# EAGLE design pcb-main (EAGLE 7.4.0)
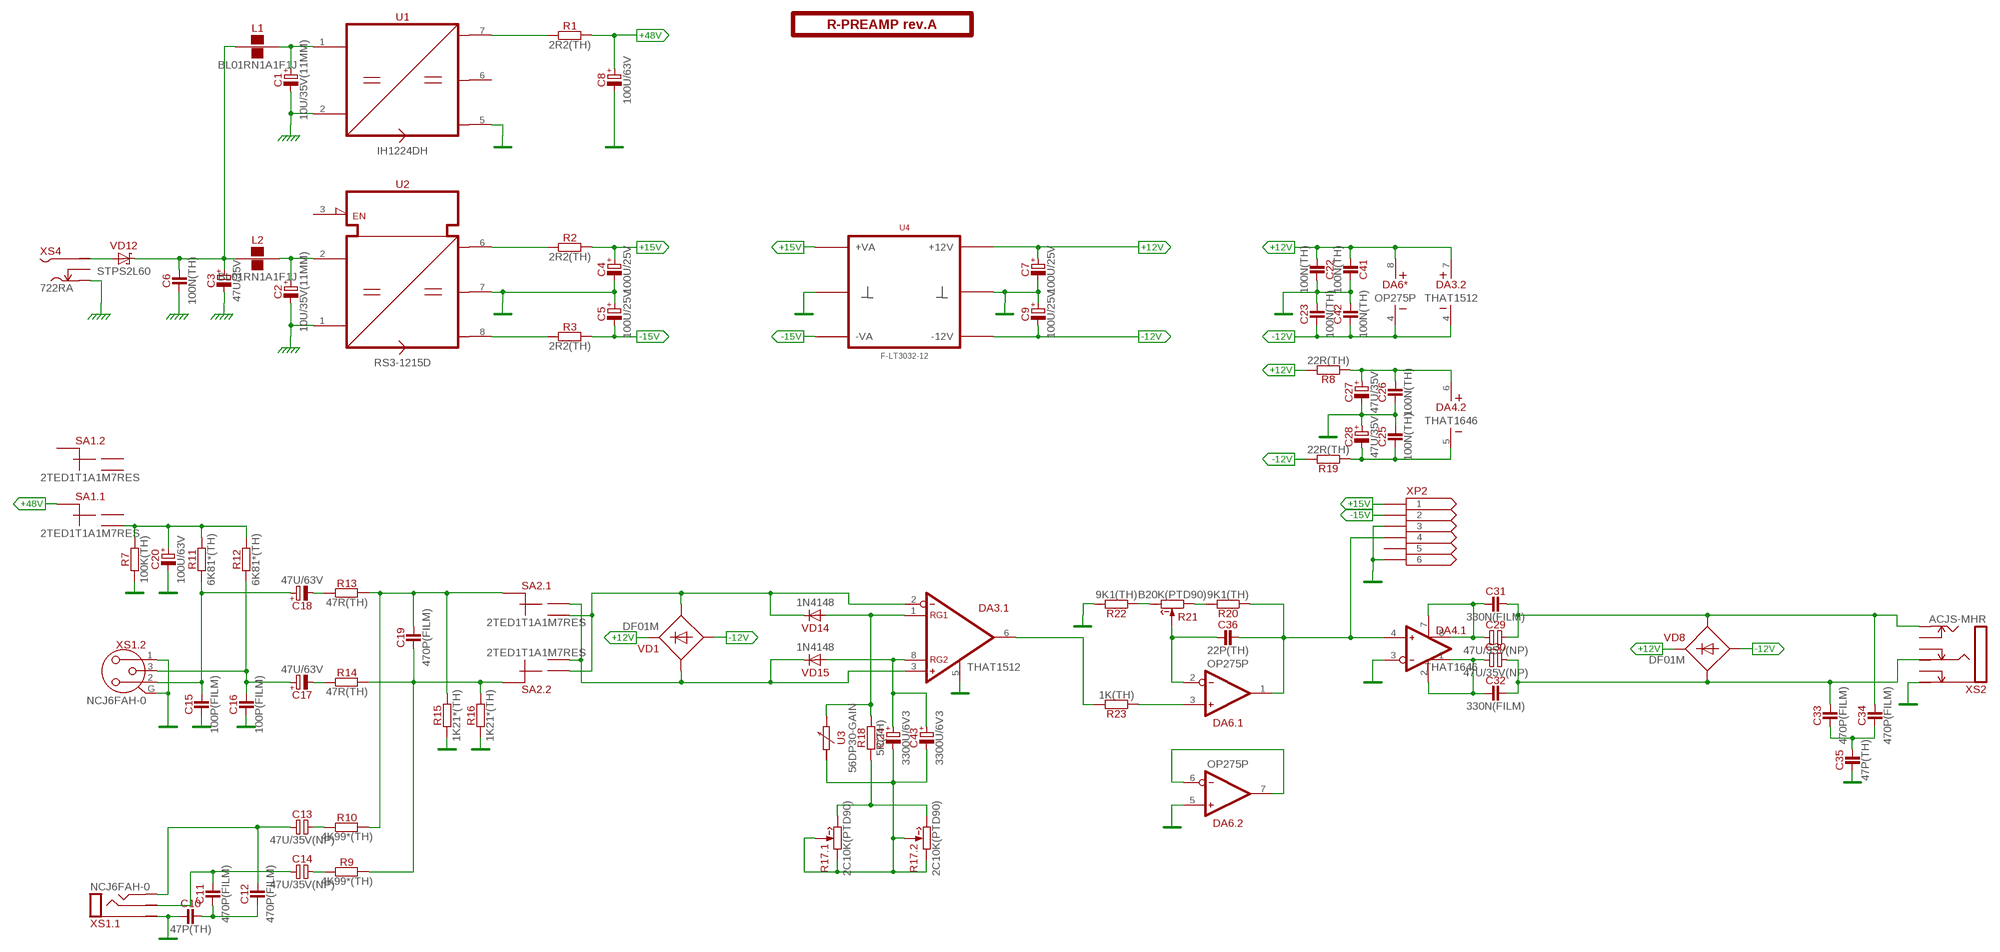
[diagram p0: schematic, sheet 1]

## Parts
C1  10U/35V(11MM)  [E2-5]
C2  10U/35V(11MM)  [E2-5]
C3  47U/35V  [E2-5]
C4  100U/25V  [E2,5-7]
C5  100U/25V  [E2,5-7]
C6  100N(TH)  [C050-024X044]
C7  100U/25V  [E2,5-7]
C8  100U/63V  [E5-10,5]
C9  100U/25V  [E2,5-7]
C10  47P(TH)  [C050-024X044]
C11  470P(FILM)  [C050-055X075]
C12  470P(FILM)  [C050-055X075]
C13  47U/35V(NP)  [E5-10,5]
C14  47U/35V(NP)  [E5-10,5]
C15  100P(FILM)  [C050-045X075]
C16  100P(FILM)  [C050-045X075]
C17  47U/63V  [E5-10,5]
C18  47U/63V  [E5-10,5]
C19  470P(FILM)  [C050-055X075]
C20  100U/63V  [E5-10,5]
C22  100N(TH)  [C050-024X044]
C23  100N(TH)  [C050-024X044]
C24  3300U/6V3  [E5-10,5]
C25  100N(TH)  [C050-024X044]
C26  100N(TH)  [C050-024X044]
C27  47U/35V  [E2-5]
C28  47U/35V  [E2-5]
C29  47U/35V(NP)  [E5-10,5]
C30  47U/35V(NP)  [E5-10,5]
C31  330N(FILM)  [C050-035X075]
C32  330N(FILM)  [C050-035X075]
C33  470P(FILM)  [C050-055X075]
C34  470P(FILM)  [C050-055X075]
C35  47P(TH)  [C050-024X044]
C36  22P(TH)  [C050-024X044]
C41  100N(TH)  [C050-024X044]
C42  100N(TH)  [C050-024X044]
C43  3300U/6V3  [E5-10,5]
DA3  THAT1512  [DIP-8]
DA4  THAT1646  [DIP-8]
DA6  OP275P  [DIP-8]
L1  BL01RN1A1F1J  [BL01RN1A]
L2  BL01RN1A1F1J  [BL01RN1A]
PCB1  R-PREAMP rev.A  GENERIC-LOGO  [F-LOGO]
R1  2R2(TH)  [R-0207/10]
R2  2R2(TH)  [R-0207/10]
R3  2R2(TH)  [R-0207/10]
R7  100K(TH)  [R-0207/10]
R8  22R(TH)  [R-0207/10]
R9  4K99*(TH)  [R-0207/10]
R10  4K99*(TH)  [R-0207/10]
R11  6K81*(TH)  [R-0207/10]
R12  6K81*(TH)  [R-0207/10]
R13  47R(TH)  [R-0207/10]
R14  47R(TH)  [R-0207/10]
R15  1K21*(TH)  [R-0207/10]
R16  1K21*(TH)  [R-0207/10]
R17  2C10K(PTD90)  [PTD902]
R18  5R(TH)  [R-0207/10]
R19  22R(TH)  [R-0207/10]
R20  9K1(TH)  [R-0207/10]
R21  B20K(PTD90)  [PTD901]
R22  9K1(TH)  [R-0207/10]
R23  1K(TH)  [R-0207/10]
SA1  2TED1T1A1M7RES  [2TED1T1A1M7RES]
SA2  2TED1T1A1M7RES  [2TED1T1A1M7RES]
U1  IH1224DH  [SIP7]
U2  RS3-1215D  [SIP8]
U3  56DP30-GAIN  F56DP  [F56DP]
U4  F-LT3032-12  F-DUAL-SUPPLY  [F-DIP8-HEATSINK]
VD1  DF01M  [MDIP-4]
VD8  DF01M  [MDIP-4]
VD12  STPS2L60  [DO41-10]
VD14  1N4148  [DO35-7]
VD15  1N4148  [DO35-7]
XP2  CONN-6-NORMAL  [MA03-2]
XS1  NCJ6FAH-0  [NCJ6FA-H-0]
XS2  ACJS-MHR  [NMJ6HC-S]
XS4  722RA  [SWITCHCRAFT-L712RA]

## Nets
+12V: C7.+ C22.2 C41.2 DA3.7(.2:V+) DA6.8(*:V+) R8.2 U4.8(P+12V) VD1.3(C) VD8.3(C)
+15V: C4.+ R2.2 U4.1(P+VA) XP2.1
+48V: C8.+ R1.2 SA1.C1(.1:CM)
-12V: C9.- C23.2 C42.2 DA3.4(.2:V-) DA6.4(*:V-) R19.2 U4.5(P-12V) VD1.4(A) VD8.4(A)
-15V: C5.- R3.2 U4.4(P-VA) XP2.2
CHASSIS: C1.- C2.- C3.- C6.1 U1.2(IN-) U2.1(IN-) XS4.S
GND: C4.- C5.+ C7.- C8.- C9.+ C10.1 C15.1 C16.1 C20.- C22.1 C23.1 C25.1 C26.2 C27.- C28.+ C35.1 C41.1 C42.1 DA3.5(.1:REF) DA4.3(.1:IN-) DA6.5(.2:IN+) R7.1 R15.1 R16.1 R22.2 U1.5(V-) U2.7(GND) U4.2(GND1) U4.3(GND1) U4.6(GND) U4.7(GND) XP2.3 XP2.6 XS1.1 XS1.G(.2:G) XS1.S(.1:S) XS2.S
N$1: C2.+ L2.2 U2.2(IN+)
N$2: VD12.A XS4.P
N$3: C1.+ L1.2 U1.1(IN+)
N$4: C13.- R10.1
N$5: C3.+ C6.2 L1.1 L2.1 VD12.C
N$6: C10.2 C11.1 C12.1
N$7: R1.1 U1.7(V+)
N$8: R2.1 U2.6(V+)
N$9: R3.1 U2.8(V-)
N$10: C11.2 C14.+ XS1.R(.1:R)
N$11: C12.2 C13.+ XS1.T1(.1:T) XS1.T2(.1:T)
N$12: C14.- R9.1
N$13: C15.2 C18.+ R11.1 XS1.2
N$14: C16.2 C17.+ R12.1 XS1.3
N$15: C26.1 C27.+ DA4.6(.2:V+) R8.1
N$16: C18.- R13.1
N$17: C17.- R14.1
N$18: DA3.2(.1:IN-) SA2.NC2 SA2.NO1 VD1.2(AC2) VD14.C
N$19: DA3.3(.1:IN+) SA2.NC1 SA2.NO2 VD1.1(AC1) VD15.C
N$21: C24.- C43.- R17.A1(CCW) R17.A2(W) R17.B1(CCW) R17.B2(W) U3.1(A) U3.2(A)
N$22: C25.2 C28.- DA4.5(.2:V-) R19.1
N$23: C20.+ R7.2 R11.2 R12.2 SA1.NO1
N$24: C29.+ C31.1 DA4.7(.1:SENS+) DA4.8(.1:OUT+)
N$25: R17.A3(CW) R17.B3(CW) R18.1
N$26: DA3.1(.1:RG1) R18.2 U3.3(E) U3.4(E) VD14.A
N$27: C24.+ C43.+ DA3.8(.1:RG2) VD15.A
N$28: C30.+ C32.1 DA4.1(.1:OUT-) DA4.2(.1:SENS-)
N$29: C29.- C31.2 C34.2 VD8.1(AC1) XS2.T
N$30: C30.- C32.2 C33.2 VD8.2(AC2) XS2.R
N$32: C33.1 C34.1 C35.2
N$33: C19.2 R10.2 R13.2 R15.2 SA2.C1(.1:CM)
N$34: C19.1 R9.2 R14.2 R16.2 SA2.C2(.2:CM)
N$35: DA6.6(.2:IN-) DA6.7(.2:OUT)
N$36: DA6.3(.1:IN+) R23.1
N$37: C36.1 DA6.2(.1:IN-) R21.2(W)
N$38: R21.3(CW) R22.1
N$39: R20.2 R21.1(CCW)
N$40: C36.2 DA4.4(.1:IN+) DA6.1(.1:OUT) R20.1 XP2.4
N$43: DA3.6(.1:OUT) R23.2
Unconnected: SA1.C2(.2:CM) SA1.NC1 SA1.NC2 SA1.NO2 U1.6(GND) U2.3(EN) XP2.5 XS2.RN XS2.SN XS2.TN XS4.SS

## Library data of the parts
C1 C2 = capacitors-electrolytic:?; MOUSER: 75-515D106M035JA6AE3
C3-C5 C7-C9 C17 C18 C20 C24 C27 C28 C43 = capacitors-electrolytic:?
C6 C22 C23 C25 C26 C41 C42 = capacitors:?; MOUSER: 81-RCER71H104K0A2H3B
C10-C12 C19 C33-C36 = capacitors:?
C13 C14 C29 C30 = capacitors-electrolytic:?(NP)
C15 C16 = capacitors:?; MOUSER: 80-PFR5101J100J11L4
C31 C32 = capacitors:?; MOUSER: 505-MKS2.33/63/10
DA3 = ic-that:THAT1512
DA4 = ic-that:THAT1646
DA6 = ic-analog-devices:OP275; MOUSER: 595-TL072IP
L1 L2 = inductors:BL01RN1A?; MOUSER: 81-BL01RN1A1F1J
PCB1 = module-footprints:GENERIC
R1-R3 R8-R16 R18-R20 R22 = resistors:?
R7 = resistors:?; MOUSER: 71-RN55D-F-100K
R17 = potentiometers:2**?(PTD90)
R21 = potentiometers:?(PTD90); MOUSER: 652-PTD901-2015KB203
R23 = resistors:?; MOUSER: 71-RN55D-F-1.0K
SA1 SA2 = switches:2TED1T1A1M7RES
U1 = regulators-switch-mode:IH1224DH
U2 = regulators-switch-mode:RS3-1215D
U3 = module-footprints:F56DP
U4 = module-footprints:F-DUAL-SUPPLY
VD1 VD8 = diodes:DF?M; MOUSER: 512-DF01M
VD12 = diodes-schottky:?; MOUSER: 511-STPS2L60RL
VD14 VD15 = diodes:?; MOUSER: 583-1N4148-T
XP2 = connectors:CONN-6-?
XS1 = connectors:NCJ6FAH-0
XS2 = connectors:ACJS-MHR; MOUSER: 523-ACJS-MHR
XS4 = connectors:722RA; MOUSER: 502-722RA

## Board
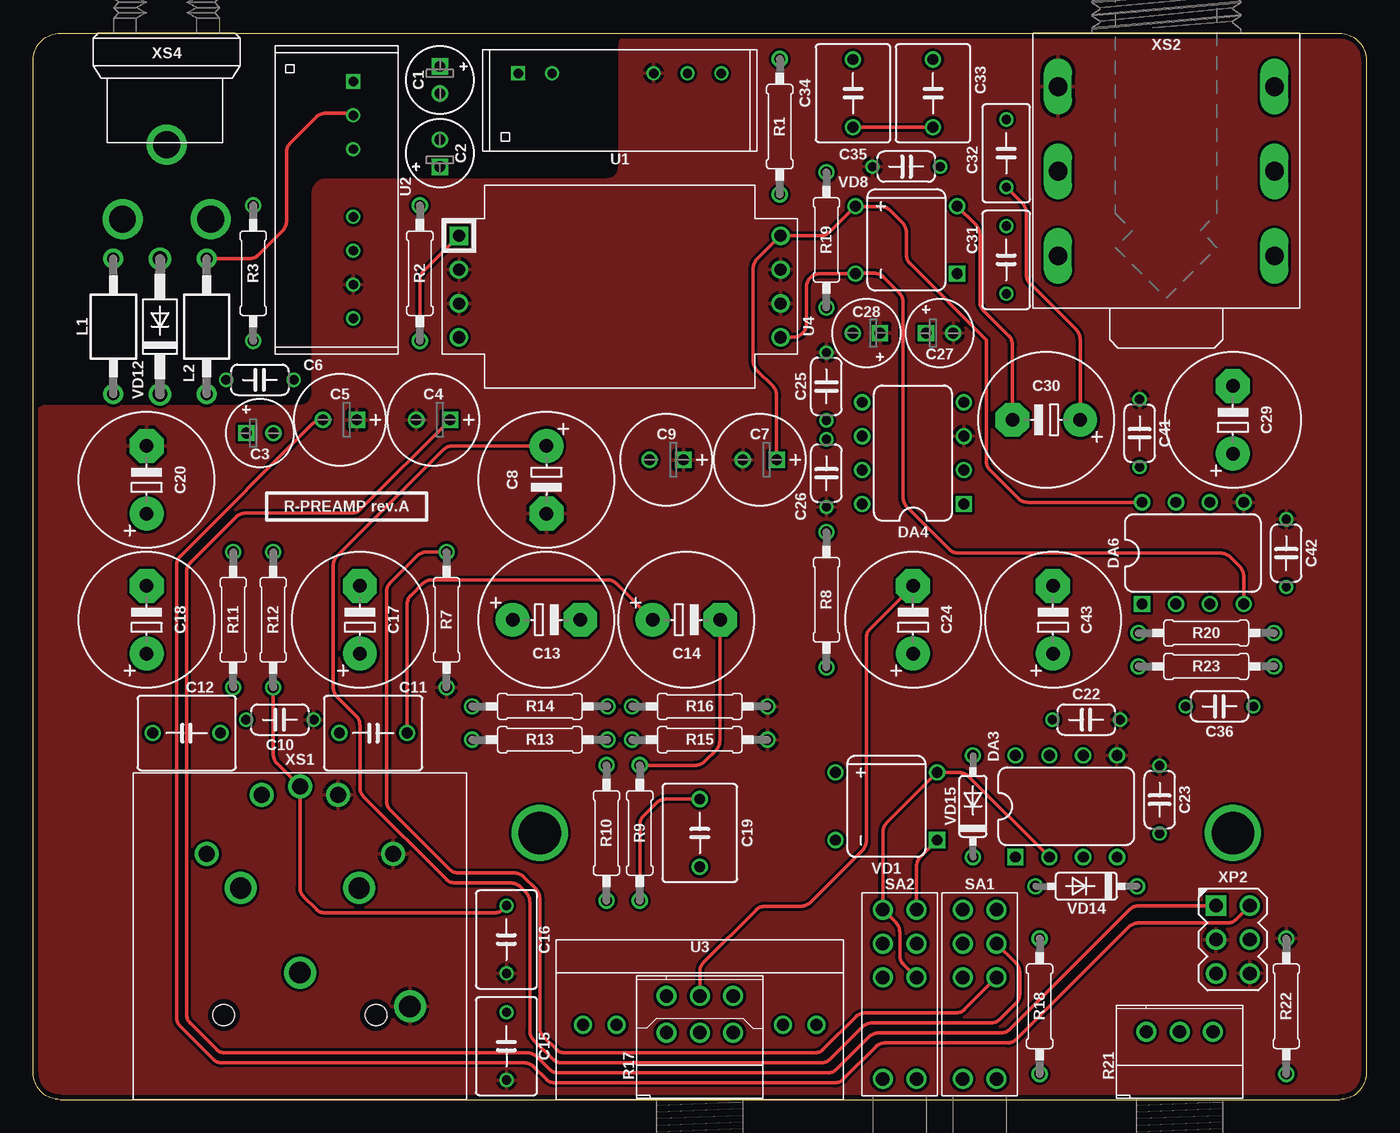
[diagram p1: board, top side]
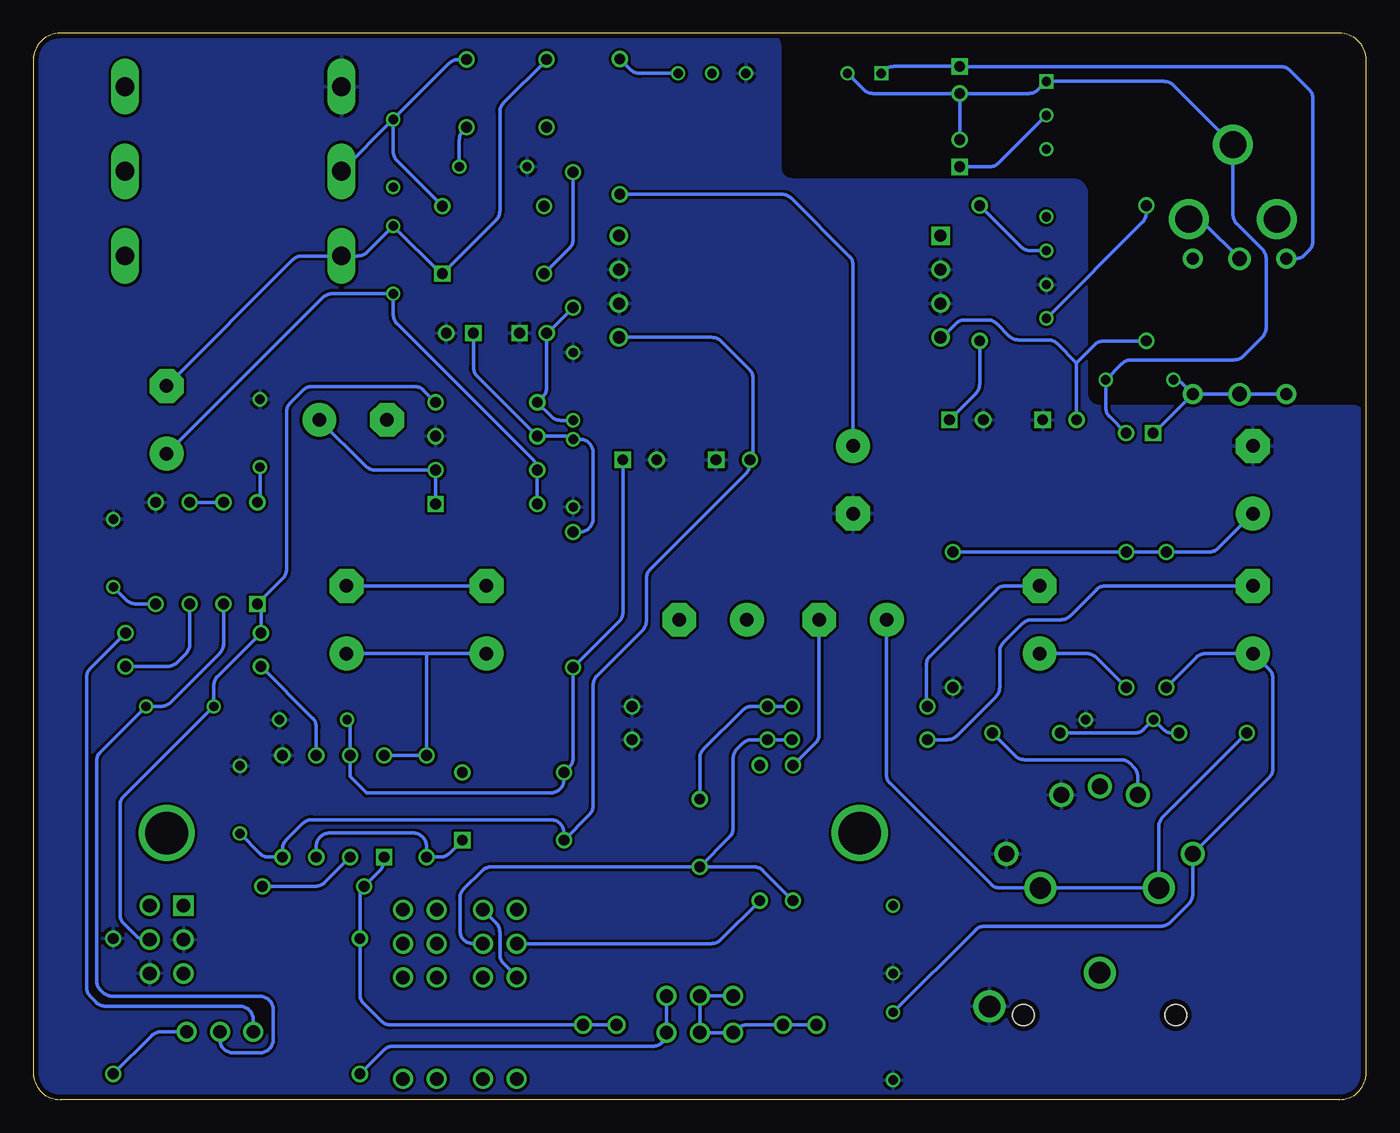
[diagram p2: board, bottom side, seen from below]

Size 100 x 80 mm. Coordinates in mm from the lower left corner, seen from the top.
Outline: 2,0 arc-90 0,2 0,78 arc-90 2,80 98,80 arc-90 100,78 100,2 arc-90 98,0 2,0
Copper layers (1*16): Top 0.0356mm / dielectric 1.5011mm / Bottom 0.0356mm
Design rules "fluorumlabs": minimum track width 6mil, minimum drill 13mil, track to track 8mil, track to pad 8mil, pad to pad 6mil, via to via 6mil, smd to smd 6mil, copper to edge 15mil, drill to drill 6mil, minimum pad ring 7mil, minimum via ring 7mil, stop-mask expansion 3mil, vias tented up to drill 25mil, thermal gap 10mil

### Footprints (pad centres in the part's own frame; a part is rotated, then mirrored left to right if it is on the bottom)
E2-5 = drill 0.813 square: + -1.016,0 | drill 0.813: - 1.016,0
E2,5-7 = drill 0.813 square: + -1.27,0 | drill 0.813: - 1.27,0
C050-024X044 = drill 0.7: 1 -2.54,0; 2 2.54,0
E5-10,5 = drill 1.016 pad 2.54: + -2.54,0 | drill 1.016 pad 2.54 octagon: - 2.54,0
C050-055X075 = drill 0.813: 1 -2.54,0; 2 2.54,0
C050-045X075 = drill 0.7: 1 -2.54,0; 2 2.54,0
C050-035X075 = drill 0.7: 1 -2.54,0; 2 2.54,0
DIP-8 = drill 0.813 square: 1 -3.81,-3.81 | drill 0.813: 2 -1.27,-3.81; 3 1.27,-3.81; 4 3.81,-3.81; 5 3.81,3.81; 6 1.27,3.81; 7 -1.27,3.81; 8 -3.81,3.81
BL01RN1A = drill 0.9 pad 1.5: 1 -5.08,0; 2 5.08,0
R-0207/10 = drill 0.813: 1 -5.08,0; 2 5.08,0
PTD902 = drill 1: A1 -2.5,5.02; A2 0,5.02; A3 2.5,5.02; B1 -2.5,7.77; B2 0,7.77; B3 2.5,7.77
PTD901 = drill 1: 1 -2.5,5.08; 2 0,5.08; 3 2.5,5.08
2TED1T1A1M7RES = drill 1: C1 1.27,11.7; C2 -1.27,11.7; NC1 1.27,14.24; NC2 -1.27,14.24; NO1 1.27,9.16; NO2 -1.27,9.16; S1 1.27,1.54; S2 -1.27,1.54
SIP7 = drill 0.7 square: 1 -7.62,0 | drill 0.7: 2 -5.08,0; 5 2.54,0; 6 5.08,0; 7 7.62,0
SIP8 = drill 0.7 square: 1 -8.89,0 | drill 0.7: 2 -6.35,0; 3 -3.81,0; 5 1.27,0; 6 3.81,0; 7 6.35,0; 8 8.89,0
F56DP = drill 0.9: 1 -8.77,5.6; 2 -6.23,5.6; 3 6.23,5.6; 4 8.77,5.6
F-DIP8-HEATSINK = drill 0.914 square: 1 -3.81,-12.065 | drill 0.914: 2 -1.27,-12.065; 3 1.27,-12.065; 4 3.81,-12.065; 5 3.81,12.065; 6 1.27,12.065; 7 -1.27,12.065; 8 -3.81,12.065
MDIP-4 = drill 0.813 square: 1 -2.54,-3.81 | drill 0.813: 2 2.54,-3.81; 3 2.54,3.81; 4 -2.54,3.81
DO41-10 = drill 1.118: A 5.08,0; C -5.08,0
DO35-7 = drill 0.813: A 3.81,0; C -3.81,0
MA03-2 = drill 1.016 square: 1 -2.54,-1.27 | drill 1.016: 2 -2.54,1.27; 3 0,-1.27; 4 0,1.27; 5 2.54,-1.27; 6 2.54,1.27
NCJ6FA-H-0 = drill 1.2: 1 -6.985,-18.415; 2 6.985,-18.415; 3 0,-23.495; R 2.857,-22.86; S -2.857,-22.86 | drill 1.6: G -8.255,-6.985; P$1 0,-9.525; T1 -4.445,-15.875; T2 4.445,-15.875 | hole 1.6: -5.715,-6.35; 5.715,-6.35
NMJ6HC-S = drill 1.4 long: R -10.35,8.115; RN -10.35,-8.115; S -4,8.115; SN -4,-8.115; T -16.7,8.115; TN -16.7,-8.115
SWITCHCRAFT-L712RA = drill 2: P 13.945,3.302; S 8.357,0; SS 13.945,-3.302

### Placement (x,y rotation side)
C1  30.5,76.5 270 top
C2  30.5,71 90 top
C3  17,50 0 top
C4  30,51 180 top
C5  23,51 180 top
C6  17,54 180 top
C7  54.5,48 180 top
C8  38.5,46.5 270 top
C9  47.5,48 180 top
C10  18.5,28.5 180 top
C11  25.5,27.5 0 top
C12  11.5,27.5 180 top
C13  38.5,36 0 top
C14  49,36 0 top
C15  35.5,4 90 top
C16  35.5,12 90 top
C17  24.5,36 90 top
C18  8.5,36 90 top
C19  50,20 270 top
C20  8.5,46.5 90 top
C22  79,28.5 180 top
C23  84.5,22.5 270 top
C24  66,36 90 top
C25  59.5,53.5 270 top
C26  59.5,47 270 top
C27  68,57.5 0 top
C28  62.5,57.5 180 top
C29  90,51 90 top
C30  76,51 180 top
C31  73,63 90 top
C32  73,71 90 top
C33  67.5,75.5 90 top
C34  61.5,75.5 90 top
C35  65.5,70 0 top
C36  89,29.5 180 top
C41  83,50 270 top
C42  94,41 270 top
C43  76.5,36 90 top
DA3  77.5,22 0 top
DA4  66,48.5 90 top
DA6  87,41 0 top
E$1  [B*-080]  0,0 0 top
L1  6,58 90 top
L2  13,58 90 top
PCB1  23.5,44.5 0 top
R1  56,73 270 top
R2  29,62 270 top
R3  16.5,62 270 top
R7  31,36 90 top
R8  59.5,37.5 270 top
R9  45.5,20 270 top
R10  43,20 270 top
R11  15,36 90 top
R12  18,36 90 top
R13  38,27 0 top
R14  38,29.5 0 top
R15  50,27 180 top
R16  50,29.5 180 top
R17  2*C10K(PTD90)  [PTD902]  50,0 0 top
R18  75.5,7 90 top
R19  59.5,64.5 90 top
R20  88,35 0 top
R21  86,0 0 top
R22  94,7 90 top
R23  88,32.5 180 top
SA1  71,0 0 top
SA2  65,0 0 top
U1  44,77 0 top
U2  24,67.5 270 top
U3  50,0 0 top
U4  44,61 270 top
VD1  64,22 90 top
VD8  65.5,64.5 90 top
VD12  9.5,58 90 top
VD14  79,16 180 top
VD15  70.5,22 90 top
XP2  90,12 270 top
XS1  20,0 180 top
XS2  85,80 90 top
XS4  10,80 270 top

### Tracks (layer width: path | path; a pad name or v marks a point on that pad's centre or on a via)
+12V
  Top 0.254: C7.+ 55.77,52.82 arc45 55.48,53.52 54.29,54.71 arc-45 54,55.41 54,62.33 arc-45 54.29,63.04 U4.8 59.05,64.81 arc45 59.75,65.1 VD8.3 61.73,67 63.59,67 arc-45 64.29,66.71 65.21,65.79 arc-45 65.5,65.09 65.5,63.41 arc45 65.79,62.71 71.5,57 71.5,47.91 arc45 71.79,47.21 73.9,45.1 arc45 74.6,44.81 DA6.8
  Bottom 0.254: C41.2 83,45 DA6.8 | C22.2 76.23,28.27 DA3.7 76.23,24.23 75,23 61.19,23 arc-90 60.19,24 VD1.3 59.79,24.94 arc-45 59.5,25.64 R8.2 56.06,35.86 arc-45 55.77,36.56 C7.+
+15V
  Top 0.254: R2.2 29,61.46 arc-45 29.29,62.17 U4.1 | XP2.1 82.95,14.54 arc45 82.25,14.25 73.29,5.29 arc-45 72.59,5 63.41,5 arc45 62.71,4.71 60.29,2.29 arc-45 59.59,2 39.41,2 arc-45 38.71,2.29 37.79,3.21 arc45 37.09,3.5 14.41,3.5 arc-45 13.71,3.79 11.79,5.71 arc-45 11.5,6.41 11.5,39.59 arc-45 11.79,40.29 15.21,43.71 arc-45 15.91,44 23.86,44 arc45 24.56,44.29 C4.+
  Bottom 0.254: R2.2 29,53.68 arc45 29.29,52.98 C4.+
+48V
  Top 0.254: C8.+ 31.45,49.04 arc45 30.75,48.75 22.79,40.79 arc45 22.5,40.09 22.5,30.91 arc45 22.79,30.21 24.21,28.79 arc-45 24.5,28.09 24.5,23.41 arc45 24.79,22.71 30.96,16.54 arc45 31.66,16.25 35.84,16.25 arc-45 36.54,15.96 36.96,15.54 arc-45 37.25,14.84 37.25,5.16 arc45 37.54,4.46 38.96,3.04 arc45 39.66,2.75 59.09,2.75 arc45 59.79,3.04 62.21,5.46 arc-45 62.91,5.75 71.84,5.75 arc45 72.54,6.04 73.71,7.21 arc45 74,7.91 74,9.56 arc45 73.71,10.26 SA1.C1
  Bottom 0.254: R1.2 43.83,67.92 arc45 43.13,67.63 38.79,63.29 arc45 38.5,62.59 C8.+
-12V
  Top 0.254: U4.5 57,57.19 arc90 58,58.19 58,60.96 arc-90 59,61.96 VD8.4 61.73,62 63.09,62 arc-45 63.79,61.71 64.96,60.54 arc-45 65.25,59.84 65.25,45.16 arc45 65.54,44.46 68.71,41.29 arc45 69.41,41 89.09,41 arc-45 89.79,40.71 90.52,39.98 arc-45 90.81,39.28 DA6.4
  Bottom 0.254: C23.2 83.02,18.48 arc-45 82.32,18.19 DA3.4 81.31,18.78 arc45 81.02,19.48 79.79,20.71 arc45 79.09,21 61.19,21 arc90 60.19,20 VD1.4 58.29,21.36 arc-45 58,22.06 58,31.09 arc45 57.71,31.79 54.29,35.21 arc-45 54,35.91 54,39.09 arc45 53.71,39.79 46.52,46.98 arc-45 46.23,47.68 C9.- 46,48.23 46,54.09 arc-45 46.29,54.79 48.4,56.9 arc-45 49.1,57.19 U4.5 | DA6.4 92.32,37.19 arc45 93.02,37.48 C42.2 | R19.2 59.5,64.56 arc45 59.79,63.86 VD8.4
-15V
  Top 0.254: XP2.2 91.27,14.52 90.29,13.54 arc-45 89.59,13.25 82.91,13.25 arc45 82.21,12.96 73.79,4.54 arc-45 73.09,4.25 63.91,4.25 arc45 63.21,3.96 60.79,1.54 arc-45 60.09,1.25 39.16,1.25 arc-45 38.46,1.54 37.54,2.46 arc45 36.84,2.75 14.16,2.75 arc-45 13.46,3.04 11.04,5.46 arc-45 10.75,6.16 10.75,40.09 arc-45 11.04,40.79 20.96,50.71 arc-45 21.66,51 C5.-
  Bottom 0.254: R3.2 19.67,56.92 arc-45 20.37,56.63 21.73,55.27 | C5.- 21.73,55.27 | U4.4 31.81,57.19 30.79,58.21 arc45 30.09,58.5 28.41,58.5 arc45 27.71,58.21 26.79,57.29 arc-45 26.09,57 23.87,57 arc45 23.17,56.71 21.73,55.27
CHASSIS
  Bottom 0.254: C3.- 19.25,51.23 arc45 19.54,51.94 C6.1 18.33,55.21 arc45 17.63,55.5 9.91,55.5 arc-45 9.21,55.79 7.79,57.21 arc-45 7.5,57.91 7.5,63.09 arc-45 7.79,63.79 9.71,65.71 arc45 10,66.41 XS4.S 14.45,76.1 arc-45 15.16,76.39 U2.1 24.61,75.78 arc45 25.32,75.48 C1.- | C1.- 36.99,75.48 arc45 37.7,75.78 U1.2 | C2.- C1.-
GND
  pour Bottom: 100,80 100,0 0,0 0,51 arc-90 1,52 20,52 arc90 21,53 21,68 arc-90 22,69 43,69 arc90 44,70 44,79 arc-90 45,80
  pour Top: 44,70 44,79 arc-90 45,80 100,80 100,0 0,0 0,51 arc-90 1,52 20,52 arc90 21,53 21,68 arc-90 22,69 43,69 arc90
N$1
  Top 0.254: L2.2 16.17,63.08 arc45 16.87,63.37 18.71,65.21 arc45 19,65.91 19,71.09 arc-45 19.29,71.79 21.21,73.71 arc-45 21.91,74 23.85,74 U2.2
  Bottom 0.254: C2.+ 28.28,69.98 arc-45 27.57,70.28 U2.2
N$2
  Bottom 0.254: XS4.P 12.89,66.06 arc45 12.18,65.76 VD12.A
N$3
  Bottom 0.254: U1.1 36.16,77.22 arc45 35.45,77.52 C1.+ 30.48,77.5 6.41,77.5 arc45 5.71,77.21 4.29,75.79 arc45 4,75.09 4,64.41 arc45 4.29,63.71 4.63,63.37 arc45 5.33,63.08 L1.2
N$4
  Bottom 0.254: C13.- 41.04,27.45 arc45 41.33,26.75 R10.1
N$5
  Bottom 0.254: L1.1 VD12.C L2.1 | C6.2 arc45 13.81,53.73 L2.1 | C3.+ 15.92,50 L2.1
N$6
  Bottom 0.254: C12.1 14.55,27.5 arc45 15.25,27.79 C10.2 16.67,27.79 arc45 17.37,27.5 C11.1
N$7
  Bottom 0.254: U1.7 54.51,77 arc45 55.21,77.29 R1.1
N$8
  Bottom 0.254: U2.6 25.2,63.69 arc45 25.9,63.98 R2.1
N$9
  Bottom 0.254: R3.1 16.5,66.52 arc45 16.79,65.82 U2.8
N$10
  Top 0.254: C11.2 28.04,37.13 arc-45 28.33,37.83 29.21,38.71 arc-45 29.91,39 43.05,39 arc-45 43.75,38.71 C14.+
  Bottom 0.254: XS1.R 17.14,24.23 arc-45 17.43,24.93 17.71,25.21 arc-45 18.41,25.5 25.63,25.5 arc45 26.33,25.79 C11.2
N$11
  Bottom 0.254: C12.2 15.26,21.2 arc-45 15.55,20.49 XS1.T2 XS1.T1 27.46,15.88 arc45 28.17,16.17 35.71,23.71 arc45 36,24.41 36,35.96 C13.+
N$12
  Top 0.254: R9.1 49.67,25.08 arc45 50.37,25.37 51.21,26.21 arc45 51.5,26.91 51.5,35.96 C14.-
N$13
  Bottom 0.254: C15.2 29.33,12.71 arc45 28.63,13 15.41,13 arc-45 14.71,13.29 13.31,14.69 arc-45 13.02,15.4 XS1.2 7.29,24.14 arc-45 7,24.84 7,31.59 arc-45 7.29,32.29 8.46,33.46 C18.+ 12.05,33.46 arc-45 12.75,33.17 R11.1
N$14
  Top 0.254: R12.1 18,25.91 arc45 18.29,25.2 XS1.3 20,15.91 arc45 20.29,15.21 21.21,14.29 arc45 21.91,14 34.55,14 arc45 35.25,14.29 C16.2
  Bottom 0.254: C17.+ 20.95,33.46 arc45 20.25,33.17 R12.1
N$15
  Bottom 0.254: C27.+ 66.98,54.98 arc-45 66.69,54.27 DA4.6 59.73,49.77 C26.1 59,49.54 arc90 58,48.54 58,43.58 arc90 59,42.58 R8.1
N$16
  Bottom 0.254: C18.- 19.55,38.54 arc-45 20.25,38.25 22.21,36.29 arc45 22.91,36 25.09,36 arc-45 25.79,35.71 27.21,34.29 arc-45 27.5,33.59 27.5,30.91 arc45 27.79,30.21 30.71,27.29 arc45 31.41,27 R13.1
N$17
  Bottom 0.254: C17.- 27.05,38.54 arc-45 27.75,38.25 32.71,33.29 arc-45 33,32.59 33,29.58 R14.1
N$18
  Top 0.254: SA2.NO1 65.29,10.14 arc-45 65,10.84 65,12.59 arc45 64.71,13.29 63.76,14.24 SA2.NC2 63.73,20.05 arc-45 64.02,20.75 VD1.2 69.47,24.54 arc-45 70.17,24.25 DA3.2
  Bottom 0.254: VD14.C 78.83,16 arc-45 78.13,16.29 DA3.2
N$19
  Top 0.254: SA2.NC1 66.27,17.51 arc-45 66.56,18.21 VD1.1
  Bottom 0.254: DA3.3 78.77,19 arc90 77.77,20 71.5,20 arc90 70.5,19 VD15.C 69.49,18.19 arc-45 68.79,18.48 VD1.1 | SA2.NO2 63.73,9.23 64.71,10.21 arc45 65,10.91 65,12.56 arc-45 65.29,13.26 SA2.NC1
N$21
  Top 0.254: R17.B2 50,9.59 arc-45 50.29,10.29 54.21,14.21 arc-45 54.91,14.5 57.59,14.5 arc45 58.29,14.79 62.21,18.71 arc45 62.5,19.41 62.5,34.63 arc-45 62.79,35.33 C24.-
  Bottom 0.254: R17.B1 R17.B2 R17.A2 R17.A1 47.21,5.31 arc45 46.51,5.6 U3.2 U3.1 | C43.- C24.-
N$22
  Bottom 0.254: C25.2 60.43,50.96 arc45 61.13,51.25 DA4.5 61.78,52.72 arc-45 61.48,53.43 C28.- 61.42,57.5 R19.1
N$23
  Top 0.254: R7.2 29.49,41.08 arc45 28.79,40.79 26.79,38.79 arc45 26.5,38.09 26.5,22.41 arc45 26.79,21.71 31.21,17.29 arc45 31.91,17 36.09,17 arc-45 36.79,16.71 37.71,15.79 arc-45 38,15.09 38,5.41 arc45 38.29,4.71 39.21,3.79 arc45 39.91,3.5 58.59,3.5 arc45 59.29,3.79 61.71,6.21 arc-45 62.41,6.5 69.2,6.5 arc45 69.9,6.79 SA1.NO1
  Bottom 0.254: C20.+ 11.09,41.37 arc45 11.79,41.08 R11.2 R12.2 R7.2
N$24
  Bottom 0.254: DA4.8 DA4.7 62.19,47.28 arc-45 62.48,47.98 72.71,58.21 arc45 73,58.91 C31.1 77.59,60.46 arc-45 78.29,60.17 C29.+
N$25
  Bottom 0.254: R17.B3 R17.A3 52.5,5 arc90 53.5,4 73.01,4 arc-45 73.71,3.71 R18.1
N$26
  Bottom 0.254: U3.3 U3.4 73.19,5.6 arc45 73.89,5.89 75.21,7.21 arc45 75.5,7.91 R18.2 75.5,15.69 VD14.A 73.98,17.21 arc-45 73.69,17.91 DA3.1
N$27
  Bottom 0.254: DA3.8 VD15.A 70.5,33.46 | C43.+ 70.5,33.46 | 70.5,33.46 C24.+
N$28
  Top 0.254: C30.+ 78.54,57.05 arc45 78.25,57.75 74.79,61.21 arc-45 74.5,61.91 74.5,66.55 arc45 74.21,67.25 C32.1
  Bottom 0.254: DA4.1 DA4.2 74.36,47.23 arc45 75.06,47.52 C30.+
N$29
  Bottom 0.254: C29.- 80.53,63.01 arc45 79.83,63.3 XS2.T 75.65,63.3 arc-45 74.95,63.59 C31.2 69.42,61.96 VD8.1 65.29,65.98 arc-45 65,66.68 65,74.09 arc45 64.71,74.79 61.5,78 C34.2
N$30
  Top 0.254: C30.- 73.46,56.63 arc45 73.17,57.33 71.29,59.21 arc-45 71,59.91 71,64.94 arc45 70.71,65.64 VD8.2
  Bottom 0.254: C32.2 73,71.14 arc-45 72.71,70.44 VD8.2 | C33.2 68.09,78.04 arc-45 68.79,77.75 C32.2 | XS2.R C32.2
N$31  (via drill 3.2)
  other vias: 38,20
N$32
  Top 0.254: C34.1 C33.1
  Bottom 0.254: C35.2 68.04,72.01 arc45 67.75,72.71 C33.1
N$33
  Bottom 0.254: R13.2 R15.2 46.09,27 arc-45 46.79,26.71 47.21,26.29 arc-45 47.5,25.59 47.5,20.37 arc45 47.79,19.67 C19.2 | C19.2 45.95,17.46 arc45 45.25,17.17 R10.2 | C19.2 65.63,17.46 arc-45 66.33,17.17 67.71,15.79 arc-45 68,15.09 68,12.7 arc-90 67,11.7 SA2.C1
N$34
  Top 0.254: C19.1 47.45,22.54 arc45 46.75,22.25 45.79,21.29 arc45 45.5,20.59 R9.2
  Bottom 0.254: R14.2 R16.2 46.09,29.5 arc-45 46.79,29.21 49.71,26.29 arc-45 50,25.59 C19.1 | SA2.C2 49.13,11.7 arc-45 48.43,11.99 R9.2
N$35
  Bottom 0.254: DA6.7 DA6.6
N$36
  Bottom 0.254: DA6.3 88.27,34.14 arc45 88.56,33.44 89.21,32.79 arc45 89.91,32.5 R23.1
N$37
  Bottom 0.254: DA6.2 85.73,34.18 arc45 86.02,33.48 89.71,29.79 arc45 90.41,29.5 C36.1 94.96,26.08 arc-45 95.25,25.38 95.25,8.91 arc-45 94.96,8.21 94.79,8.04 arc-45 94.09,7.75 83,7.75 arc90 82,6.75 82,4.5 arc90 83,3.5 85,3.5 arc90 86,4.5 R21.2
N$38
  Bottom 0.254: R21.3 90.43,5.08 arc-45 91.13,4.79 R22.1
N$39
  Bottom 0.254: R21.1 83.5,6 arc-90 84.5,7 94.59,7 arc45 95.29,7.29 95.71,7.71 arc45 96,8.41 96,31.67 arc45 95.71,32.37 R20.2
N$40
  Bottom 0.254: DA4.4 70.71,53.21 arc-45 71.41,53.5 79.09,53.5 arc-45 79.79,53.21 80.71,52.29 arc-45 81,51.59 81,39.79 arc45 81.29,39.09 DA6.1 82.92,36.92 R20.1 86.17,31.75 arc-45 86.46,31.05 C36.2 93.21,22.75 arc-45 93.5,22.05 93.5,13.91 arc-45 93.21,13.21 92.29,12.29 arc-45 91.59,12 XP2.4
N$41  (via drill 3.2)
  other vias: 90,20
N$43
  Bottom 0.254: DA3.6 78.77,27.94 arc-45 79.06,28.64 R23.2